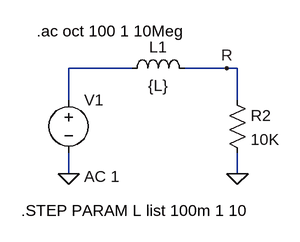
[diagram p0: schematic Fig_6-16_AC_L-R_sweep.asc]
Fig_6-16_AC_L-R_sweep.asc, the LTspice schematic file:
Version 4
SHEET 1 880 680
WIRE 336 80 240 80
WIRE 480 80 416 80
WIRE 496 80 480 80
WIRE 240 128 240 80
WIRE 496 128 496 80
WIRE 240 240 240 208
WIRE 496 240 496 208
FLAG 240 240 0
FLAG 496 240 0
FLAG 480 80 R
SYMBOL res 480 112 R0
SYMATTR InstName R2
SYMATTR Value 10K
SYMBOL ind 320 96 R270
WINDOW 0 32 56 VTop 2
WINDOW 3 5 56 VBottom 2
SYMATTR InstName L1
SYMATTR Value {L}
SYMBOL voltage 240 112 R0
WINDOW 123 24 132 Left 2
WINDOW 39 0 0 Left 2
SYMATTR Value2 AC 1
SYMATTR InstName V1
SYMATTR Value ""
TEXT 192 24 Left 2 !.ac oct 100 1 10Meg
TEXT 168 296 Left 2 !.STEP PARAM L list 100m 1 10

The netlist it stands for:
* Fig_6-16_AC_L-R_sweep.asc
R2 R 0 10K
L1 N001 R {L}
V1 N001 0 AC 1
.ac oct 100 1 10Meg
.STEP PARAM L list 100m 1 10
.backanno
.end